# Altium schematic sheet IO_Connectors.SchDoc
size A4; SheetNumber: 3; SheetTotal: 3
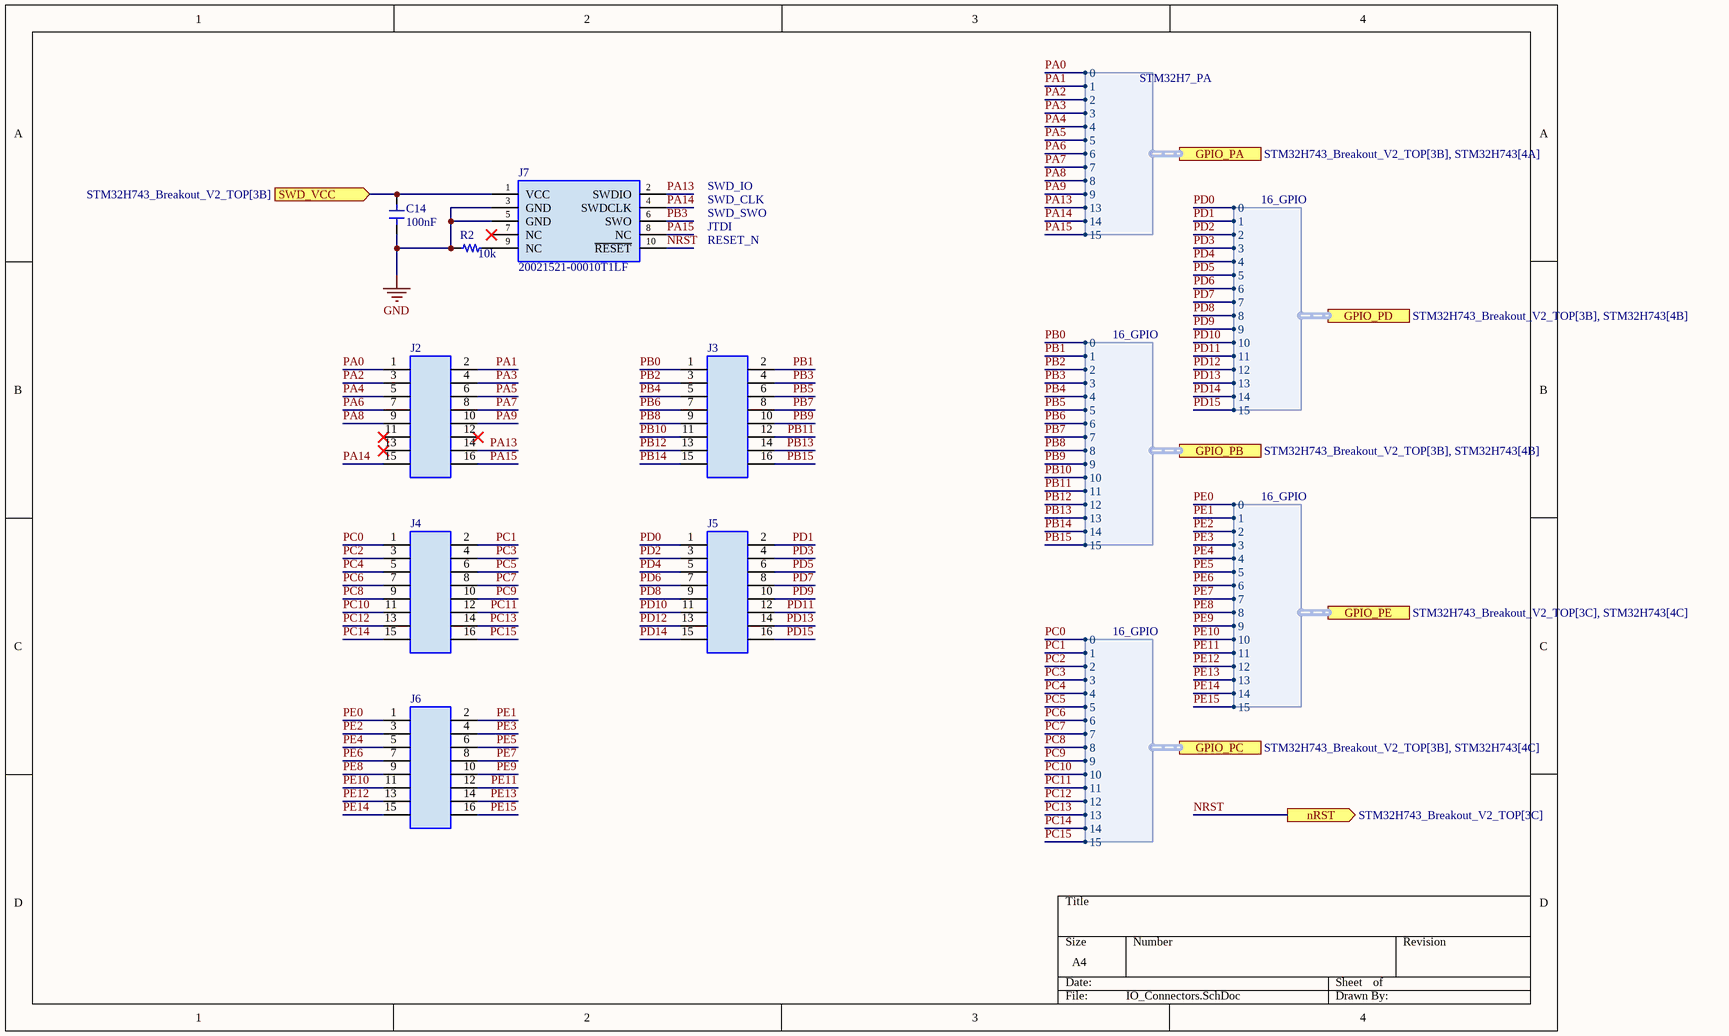
[diagram p0: IO_Connectors.SchDoc]

## Parts
C14  Capacitance: 100nF  [C-0603]  (hidden comment: C 0603 100nF 10% 50V X7R)
J2  SULLINS_PPPC082LFBN-RC  [2.54_08x02_female_header]  (value not drawn)
J3  SULLINS_PPPC082LFBN-RC  [2.54_08x02_female_header]  (value not drawn)
J4  SULLINS_PPPC082LFBN-RC  [2.54_08x02_female_header]  (value not drawn)
J5  SULLINS_PPPC082LFBN-RC  [2.54_08x02_female_header]  (value not drawn)
J6  SULLINS_PPPC082LFBN-RC  [2.54_08x02_female_header]  (value not drawn)
J7  20021521-00010T1LF  [20021521-00010T1LF]
R2  Resistance: 10k  [R-0603]  (hidden comment: R 0603 100 1% 0.100W 100PPM)

## Ports
GPIO_PA (harness STM32H7_PA, see STM32H743_Breakout_V2_TOP[3B], STM32H743[4A]), GPIO_PB (harness 16_GPIO, see STM32H743_Breakout_V2_TOP[3B], STM32H743[4B]), GPIO_PC (harness 16_GPIO, see STM32H743_Breakout_V2_TOP[3B], STM32H743[4C]), GPIO_PD (harness 16_GPIO, see STM32H743_Breakout_V2_TOP[3B], STM32H743[4B]), GPIO_PE (harness 16_GPIO, see STM32H743_Breakout_V2_TOP[3C], STM32H743[4C]), nRST (out, see STM32H743_Breakout_V2_TOP[3C]), SWD_VCC (in, see STM32H743_Breakout_V2_TOP[3B])

## Harnesses
STM32H7_PA: 0, 1, 2, 3, 4, 5, 6, 7, 8, 9, 13, 14, 15
16_GPIO: 0, 1, 2, 3, 4, 5, 6, 7, 8, 9, 10, 11, 12, 13, 14, 15

## Nets
GND: C14.1 J7.3(GND) J7.5(GND) R2.1
NRST: J7.10(~{RESET}) ; port nRST
PA0: J2.1 ; port GPIO_PA.0
PA1: J2.2 ; port GPIO_PA.1
PA2: J2.3 ; port GPIO_PA.2
PA3: J2.4 ; port GPIO_PA.3
PA4: J2.5 ; port GPIO_PA.4
PA5: J2.6 ; port GPIO_PA.5
PA6: J2.7 ; port GPIO_PA.6
PA7: J2.8 ; port GPIO_PA.7
PA8: J2.9 ; port GPIO_PA.8
PA9: J2.10 ; port GPIO_PA.9
PA13: J2.14 J7.2(SWDIO) ; port GPIO_PA.13
PA14: J2.15 J7.4(SWDCLK) ; port GPIO_PA.14
PA15: J2.16 J7.8(NC) ; port GPIO_PA.15
PB0: J3.1 ; port GPIO_PB.0
PB1: J3.2 ; port GPIO_PB.1
PB2: J3.3 ; port GPIO_PB.2
PB3: J3.4 J7.6(SWO) ; port GPIO_PB.3
PB4: J3.5 ; port GPIO_PB.4
PB5: J3.6 ; port GPIO_PB.5
PB6: J3.7 ; port GPIO_PB.6
PB7: J3.8 ; port GPIO_PB.7
PB8: J3.9 ; port GPIO_PB.8
PB9: J3.10 ; port GPIO_PB.9
PB10: J3.11 ; port GPIO_PB.10
PB11: J3.12 ; port GPIO_PB.11
PB12: J3.13 ; port GPIO_PB.12
PB13: J3.14 ; port GPIO_PB.13
PB14: J3.15 ; port GPIO_PB.14
PB15: J3.16 ; port GPIO_PB.15
PC0: J4.1 ; port GPIO_PC.0
PC1: J4.2 ; port GPIO_PC.1
PC2: J4.3 ; port GPIO_PC.2
PC3: J4.4 ; port GPIO_PC.3
PC4: J4.5 ; port GPIO_PC.4
PC5: J4.6 ; port GPIO_PC.5
PC6: J4.7 ; port GPIO_PC.6
PC7: J4.8 ; port GPIO_PC.7
PC8: J4.9 ; port GPIO_PC.8
PC9: J4.10 ; port GPIO_PC.9
PC10: J4.11 ; port GPIO_PC.10
PC11: J4.12 ; port GPIO_PC.11
PC12: J4.13 ; port GPIO_PC.12
PC13: J4.14 ; port GPIO_PC.13
PC14: J4.15 ; port GPIO_PC.14
PC15: J4.16 ; port GPIO_PC.15
PD0: J5.1 ; port GPIO_PD.0
PD1: J5.2 ; port GPIO_PD.1
PD2: J5.3 ; port GPIO_PD.2
PD3: J5.4 ; port GPIO_PD.3
PD4: J5.5 ; port GPIO_PD.4
PD5: J5.6 ; port GPIO_PD.5
PD6: J5.7 ; port GPIO_PD.6
PD7: J5.8 ; port GPIO_PD.7
PD8: J5.9 ; port GPIO_PD.8
PD9: J5.10 ; port GPIO_PD.9
PD10: J5.11 ; port GPIO_PD.10
PD11: J5.12 ; port GPIO_PD.11
PD12: J5.13 ; port GPIO_PD.12
PD13: J5.14 ; port GPIO_PD.13
PD14: J5.15 ; port GPIO_PD.14
PD15: J5.16 ; port GPIO_PD.15
PE0: J6.1 ; port GPIO_PE.0
PE1: J6.2 ; port GPIO_PE.1
PE2: J6.3 ; port GPIO_PE.2
PE3: J6.4 ; port GPIO_PE.3
PE4: J6.5 ; port GPIO_PE.4
PE5: J6.6 ; port GPIO_PE.5
PE6: J6.7 ; port GPIO_PE.6
PE7: J6.8 ; port GPIO_PE.7
PE8: J6.9 ; port GPIO_PE.8
PE9: J6.10 ; port GPIO_PE.9
PE10: J6.11 ; port GPIO_PE.10
PE11: J6.12 ; port GPIO_PE.11
PE12: J6.13 ; port GPIO_PE.12
PE13: J6.14 ; port GPIO_PE.13
PE14: J6.15 ; port GPIO_PE.14
PE15: J6.16 ; port GPIO_PE.15
SWD_VCC: C14.2 J7.1(VCC) ; port SWD_VCC
NetJ7_9: J7.9(NC) R2.2

Not connected (* = marked no-connect by the designer): J2 11* 12* 13*; J7 7(NC)*

## Notes on the sheet
- JTDI
- RESET_N
- SWD_SWO
- SWD_CLK
- SWD_IO

## Library data of the parts
C14 = CMP-00008-4: SMD Capacitor, Ceramic; Voltage: 50V; Tolerance: 10%; Dielectric: X7R; Case/Package: 0603; Dielectric Material: Ceramic; RoHS: Yes; Min Operating Temperature: -55°C; Max Operating Temperature: 125°C; LCSC P/N: C14663
J2-J6 = CMP-00121-1: 2.54mm pitch 8x2 female pin header; Digikey P/N: S7111-ND
J7 = CMP-00019-7: 1.27mm Pitch Micro Header, 2x5Pos SMD, Shrouded, SWD/JTAG; Voltage Rating (DC): 125V; Current Rating Per Contact: 1A; Connector Type: Header, SWD/JTAG; Number of Contacts: 10; Max Operating Temperature: 105°C; RoHS: Yes; Digikey P/N: 609-4054-ND; Mount: SMD; Voltage Rating (AC): 125V; Orientation: Straight; Min Operating Temperature: -40°C
R2 = CMP-00095-1: SMD Resistor, Thick Film; Power Rating: 100mW; Voltage Rating: 75V; Tolerance: 1%; Case/Package: 0603; LCSC P/N: C25804; Composition: Thick Film; RoHS: Yes; Min Operating Temperature: -55°C; Max Operating Temperature: 155°C; Temperature Coefficient: 100ppm